# EasyEDA Pro project H桥.eprj, schematic 单相_TDSON-8
Board Name: 单相_贴片; Create Date: 2025-08-14; Page Name: P1; Project Name: H桥; Schematic Name: 单相_贴片; Update Date: 2025-08-14; Company: 嘉立创EDA; Page Size: A4; Version: V1.0
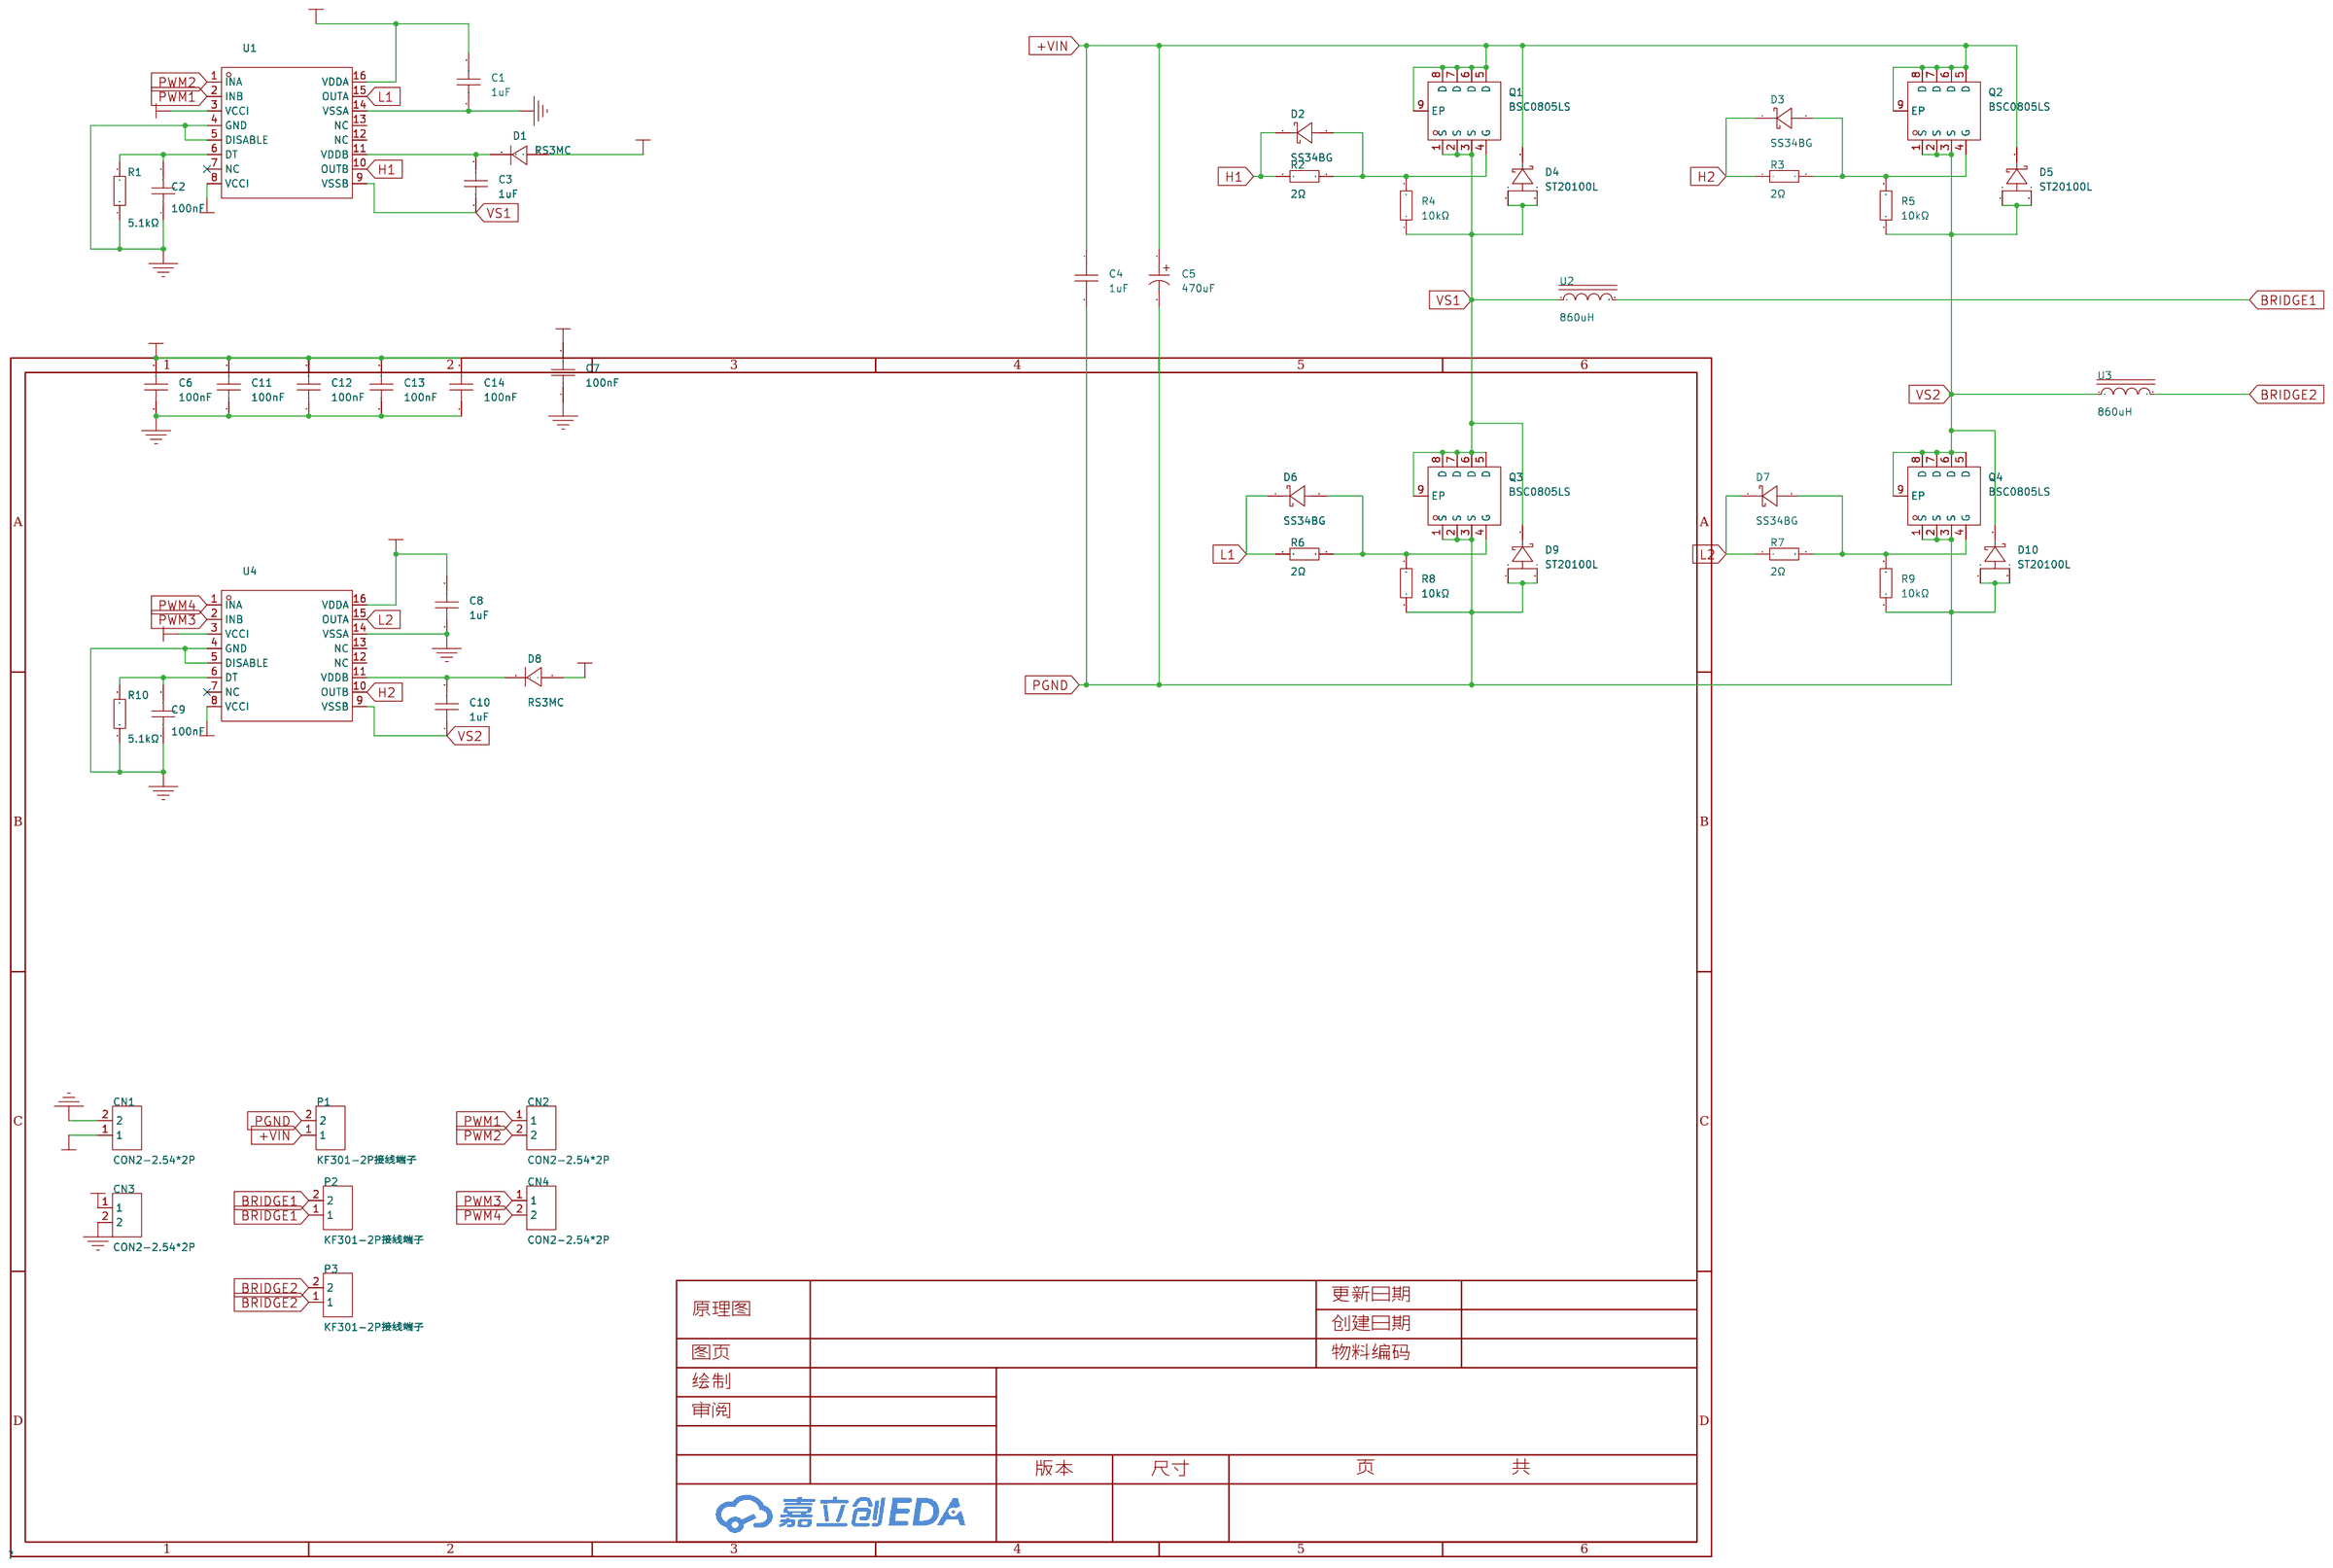
[diagram p2: schematic sheet]

## Parts
C1  1uF  [C0805]
C2  100nF  [C0805]
C3  1uF  [C0805]
C4  1uF  [CAP-TH_L26.5-W10.0-P22.50-D1.4]
C5  470uF  [CAP-TH_BD16.0-P7.50-D1.2-FD]
C6  100nF  [C0805]
C7  100nF  [C0805]
C8  1uF  [C0805]
C9  100nF  [C0805]
C10  1uF  [C0805]
C11  100nF  [C0805]
C12  100nF  [C0805]
C13  100nF  [C0805]
C14  100nF  [C0805]
CN1  CON2-2.54*2P  [CONN-TH_2P-P2.54-V]
CN2  CON2-2.54*2P  [CONN-TH_2P-P2.54-V]
CN3  CON2-2.54*2P  [CONN-TH_2P-P2.54-V]
CN4  CON2-2.54*2P  [CONN-TH_2P-P2.54-V]
D1  RS3MC  [SMC_L7.1-W6.2-LS8.1-R-RD]
D2  SS34BG  [SMB_L4.6-W3.6-LS5.3-RD]
D3  SS34BG  [SMB_L4.6-W3.6-LS5.3-RD]
D4  ST20100L  [TO-277_3P-L5.7-W4.2-LS6.5-BR]
D5  ST20100L  [TO-277_3P-L5.7-W4.2-LS6.5-BR]
D6  SS34BG  [SMB_L4.6-W3.6-LS5.3-RD]
D7  SS34BG  [SMB_L4.6-W3.6-LS5.3-RD]
D8  RS3MC  [SMC_L7.1-W6.2-LS8.1-R-RD]
D9  ST20100L  [TO-277_3P-L5.7-W4.2-LS6.5-BR]
D10  ST20100L  [TO-277_3P-L5.7-W4.2-LS6.5-BR]
P1  KF301-2P接线端子  [CONN-TH_XY301V-A-5.0-2P]
P2  KF301-2P接线端子  [CONN-TH_XY301V-A-5.0-2P]
P3  KF301-2P接线端子  [CONN-TH_XY301V-A-5.0-2P]
Q1  BSC0805LS  [PG-TDSON-8_L5.2-W5.9-P1.27-LS6.2-BL-EP]
Q2  BSC0805LS  [PG-TDSON-8_L5.2-W5.9-P1.27-LS6.2-BL-EP]
Q3  BSC0805LS  [PG-TDSON-8_L5.2-W5.9-P1.27-LS6.2-BL-EP]
Q4  BSC0805LS  [PG-TDSON-8_L5.2-W5.9-P1.27-LS6.2-BL-EP]
R1  20kΩ  [R0805]
R2  2Ω  [R0805]
R3  2Ω  [R0805]
R4  10kΩ  [R0805]
R5  10kΩ  [R0805]
R6  2Ω  [R0805]
R7  2Ω  [R0805]
R8  10kΩ  [R0805]
R9  10kΩ  [R0805]
R10  20kΩ  [R0805]
U1  UCC21520  [SOIC-16_L10.3-W7.5-P1.27-LS10.3-BL]
U2  860uH  [IND-TH_L29.0-W16.0-P14.00-D0.8]
U3  860uH  [IND-TH_L29.0-W16.0-P14.00-D0.8]
U4  UCC21520  [SOIC-16_L10.3-W7.5-P1.27-LS10.3-BL]

## Library data of the parts
C1 C3 C6-C8 C10-C14 = CAP_0805: Supplier Footprint: 0805
C2 C9 = 1C25X7R473K100B: 容值:47nF;精度:±10%;额定电压:100V;温度系数:X7R;; LCSC Part Name: 47nF ±10% 100V; Supplier Part: C1630512; Manufacturer: VISHAY(威世); Supplier Footprint: 插件,P=6.35mm; JLCPCB Part Class: Extended Part; Datasheet: https://atta.szlcsc.com/upload/public/pdf/source/20210701/0CF1A7AD3406E72B391D35880AF61B15.pdf; Supplier: LCSC; Tolerance: ±10%; Voltage Rated: 100V; Temperature Coefficient: X7R
C4 = C322J474J90C000: LCSC Part Name: 470nF ±5% 630V; Supplier Part: C401319; Manufacturer: faratronic(厦门法拉); Supplier Footprint: 插件,P=22.5mm; JLCPCB Part Class: 扩展库; Datasheet: https://atta.szlcsc.com/upload/public/pdf/source/20190702/C401136_4E449A5F5E1485A05AFFA403AF8D4B3E.pdf; Supplier: LCSC; Tolerance: ±5%; Voltage Rated: 630V
C5 = CD11Z 100V470μF: 容值:470uF;额定电压:100V;纹波电流:-;等效串联电阻:-;; LCSC Part Name: 470uF 100V; Supplier Part: C1692765; Manufacturer: DMEGC(东磁); Supplier Footprint: 插件,D16xL25mm; JLCPCB Part Class: 扩展库; Datasheet: https://atta.szlcsc.com/upload/public/pdf/source/20210111/C1692765_3DA9E861BF574BA4CB3EF792989E2CF7.pdf; Supplier: LCSC; Rated Voltage: 100V
CN1-CN4 = CON2-2.54*2P: Supplier Part: C9900003238; Supplier Footprint: TH-2P; JLCPCB Part Class: Extended Part; Supplier: LCSC
D1 D8 = RS3MC_C15283: 二极管配置:独立式;正向压降(Vf):1.3V@3A;直流反向耐压(Vr):1kV;整流电流:3A;反向恢复时间(trr):500ns;; LCSC Part Name: 电压:1kV 电流:3A; Supplier Part: C15283; Manufacturer: MDD(辰达半导体); Supplier Footprint: SMC; JLCPCB Part Class: 扩展库; Datasheet: https://atta.szlcsc.com/upload/public/pdf/source/20240809/311FA8487617F5AA976E3BC15CA3A541.pdf; Supplier: LCSC; Diode Configuration: 独立式; Forward Voltage (Vf@If): 1.3V@3A; Reverse Voltage (Vr): 1kV; Rectified Current: 3A; Reverse Leakage Current: 5uA@1kV; Reverse Recovery Time (trr): 500ns; Operating Temperature: -55℃~+150℃@(Tj)
D2 D3 D6 D7 = SS34BG: LCSC Part Name: 电压:40V 电流:3A; Supplier Part: C719397; Manufacturer: SHIKUES(时科); Supplier Footprint: SMB; JLCPCB Part Class: 扩展库; Datasheet: https://atta.szlcsc.com/upload/public/pdf/source/20200825/C719396_E39605378EBDC67A0B7AD53C9B61FDD8.pdf; Supplier: LCSC; Diode Configuration: 独立式; Forward Voltage (Vf@If): 550mV@3A; Reverse Voltage (Vr): 40V; Average Rectified Current (Io): 3A; Reverse Leakage Current (Ir): 500uA@40V
D4 D5 D9 D10 = ST20100L: LCSC Part Name: 电压:100V 电流:20A; Supplier Part: C2693410; Manufacturer: CJ(江苏长电/长晶); Supplier Footprint: TO-277; JLCPCB Part Class: 扩展库; Datasheet: https://atta.szlcsc.com/upload/public/pdf/source/20210330/C2693410_9551F5ED840A67394421895091158B3C.pdf; Supplier: LCSC; Diode Configuration: 独立式; Voltage - Forward(Vf@If): 650mV@20A; Voltage - DC Reverse(Vr): 100V; Current - Rectified: 20A; Reverse Leakage Current (Ir): 30uA@100V
P1-P3 = KF301-2P接线端子: Supplier Part: C9900016950; Supplier Footprint: CK301-2P; JLCPCB Part Class: 扩展库; Supplier: LCSC
Q1-Q4 = BSC0805LS: LCSC Part Name: 1个N沟道 耐压:100V 电流:61A; Supplier Part: C534374; Manufacturer: Infineon(英飞凌); Supplier Footprint: TDSON-8(5x6); JLCPCB Part Class: 扩展库; Datasheet: https://atta.szlcsc.com/upload/public/pdf/source/20200515/C534374_66950A10506F19F261C25E6ECF73BC74.pdf; Supplier: LCSC; Number: 1个N沟道; Drain to Source Voltage: 100V; Current - Continuous Drain(Id): 61A; Pd - Power Dissipation: 2.5W; Gate Threshold Voltage (Vgs(th)): 2.3V; Gate Charge(Qg): 16nC; Input Capacitance(Ciss): 2.7nF@50V; Reverse Transfer Capacitance (Crss@Vds): 28pF@50V; Operating Temperature: -55℃~+150℃
R1 R10 = 20kΩ: 电阻类型:金属膜电阻;阻值:20kΩ;精度:±1%;功率:500mW;温度系数:±50ppm/℃;; LCSC Part Name: 金属膜电阻 20kΩ ±1% 500mW; Supplier Part: C173146; Manufacturer: YAGEO(国巨); Manufacturer Part: MFR50SFTE52-20K; Supplier Footprint: 插件,D2.4xL6.3mm; JLCPCB Part Class: 扩展库; Datasheet: https://atta.szlcsc.com/upload/public/pdf/source/20191118/C457825_18355E864DE4965678DC27B0EBC3E21E.pdf; Supplier: LCSC; Type: 金属膜电阻; Tolerance: ±1%; Power(Watts): 500mW; Temperature Coefficient: ±50ppm/℃; Operating Temperature Range: -55℃~+155℃; Origin Footprint 2: RES-TH_BD2.4-L6.3-P10.30-D0.6; Origin Footprint 1: MFR50SFTE52-20K
R2-R9 = Res_AXIAL-1/8W: Supplier Footprint: 轴向引线
U1 U4 = UCC21520: Supplier: LCSC; Supplier Part: C601651; Manufacturer: TI(德州仪器); JLCPCB Part Class: Extended Part
U2 U3 = YDTC90125-861L: LCSC Part Name: TC90125 860uH@10KHz 150mΩ 3A; Supplier Part: C22395844; Manufacturer: YJYCOIN(益嘉源); Supplier Footprint: 插件,P=14mm; Datasheet: https://atta.szlcsc.com/upload/public/pdf/source/20240511/73FAF6FE8F8F84F1808BB18923905892.pdf; Supplier: LCSC; Tolerance: ±20%

## Nets
+5V: C6.2 C11.2 C12.2 C13.2 C14.2 CN3.1 U1.3(VCCI) U1.8(VCCI) U4.3(VCCI) U4.8(VCCI)
+12V: C1.2 C7.2 C8.2 CN1.1 D1.1(A) D8.1(A) U1.16(VDDA) U4.16(VDDA)
+VIN: C4.1 C5.1 D4.2(K) D5.2(K) P1.1 Q1.5(D) Q1.6(D) Q1.7(D) Q1.8(D) Q1.9(EP) Q2.5(D) Q2.6(D) Q2.7(D) Q2.8(D) Q2.9(EP)
DGND: C2.1 C6.1 C9.1 C11.1 C12.1 C13.1 C14.1 CN3.2 R1.1 R10.1 U1.4(GND) U1.5(DISABLE) U4.4(GND) U4.5(DISABLE)
PGND: C1.1 C4.2 C5.2 C7.1 C8.1 CN1.2 D9.1(A) D9.3(A) D10.1(A) D10.3(A) P1.2 Q3.1(S) Q3.2(S) Q3.3(S) Q4.1(S) Q4.2(S) Q4.3(S) R8.1 R9.1 U1.14(VSSA) U4.14(VSSA)
BRIDGE1: P2.1 P2.2 U2.2
BRIDGE2: P3.1 P3.2 U3.2
H1: D2.1(K) R2.1 U1.10(OUTB)
H2: D3.1(K) R3.1 U4.10(OUTB)
L1: D6.1(K) R6.1 U1.15(OUTA)
L2: D7.1(K) R7.1 U4.15(OUTA)
PWM1: CN2.1 U1.2(INB)
PWM2: CN2.2 U1.1(INA)
PWM3: CN4.1 U4.2(INB)
PWM4: CN4.2 U4.1(INA)
VS1: C3.1 D4.1(A) D4.3(A) D9.2(K) Q1.1(S) Q1.2(S) Q1.3(S) Q3.5(D) Q3.6(D) Q3.7(D) Q3.8(D) Q3.9(EP) R4.1 U1.9(VSSB) U2.1
VS2: C10.1 D5.1(A) D5.3(A) D10.2(K) Q2.1(S) Q2.2(S) Q2.3(S) Q4.5(D) Q4.6(D) Q4.7(D) Q4.8(D) Q4.9(EP) R5.1 U3.1 U4.9(VSSB)
$1N2033: D6.2(A) Q3.4(G) R6.2 R8.2
$1N2035: D2.2(A) Q1.4(G) R2.2 R4.2
$1N2037: D3.2(A) Q2.4(G) R3.2 R5.2
$1N2039: D7.2(A) Q4.4(G) R7.2 R9.2
$1N2046: C9.2 R10.2 U4.6(DT)
$1N2049: C3.2 D1.2(K) U1.11(VDDB)
$1N2054: C2.2 R1.2 U1.6(DT)
$1N4233: C10.2 D8.2(K) U4.11(VDDB)

Not connected (* = marked no-connect by the designer): U1 7(NC)* 12(NC) 13(NC); U4 7(NC)* 12(NC) 13(NC)
